# EAGLE board mother-002 (EAGLE 4.16)
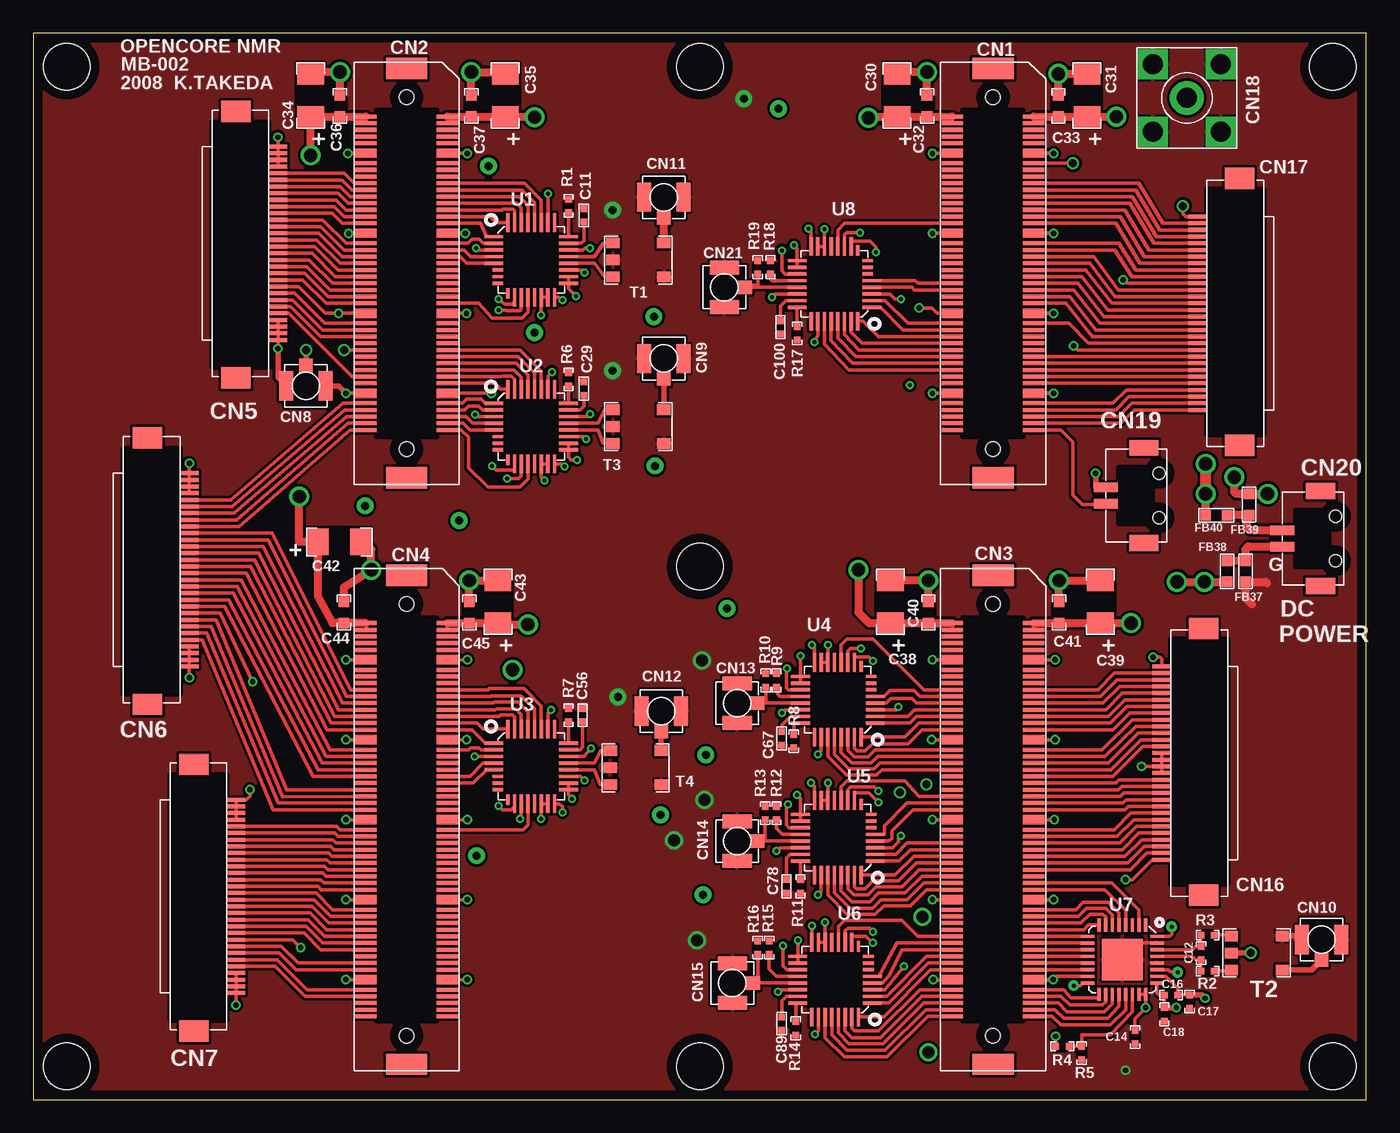
[diagram p14: board, top side]
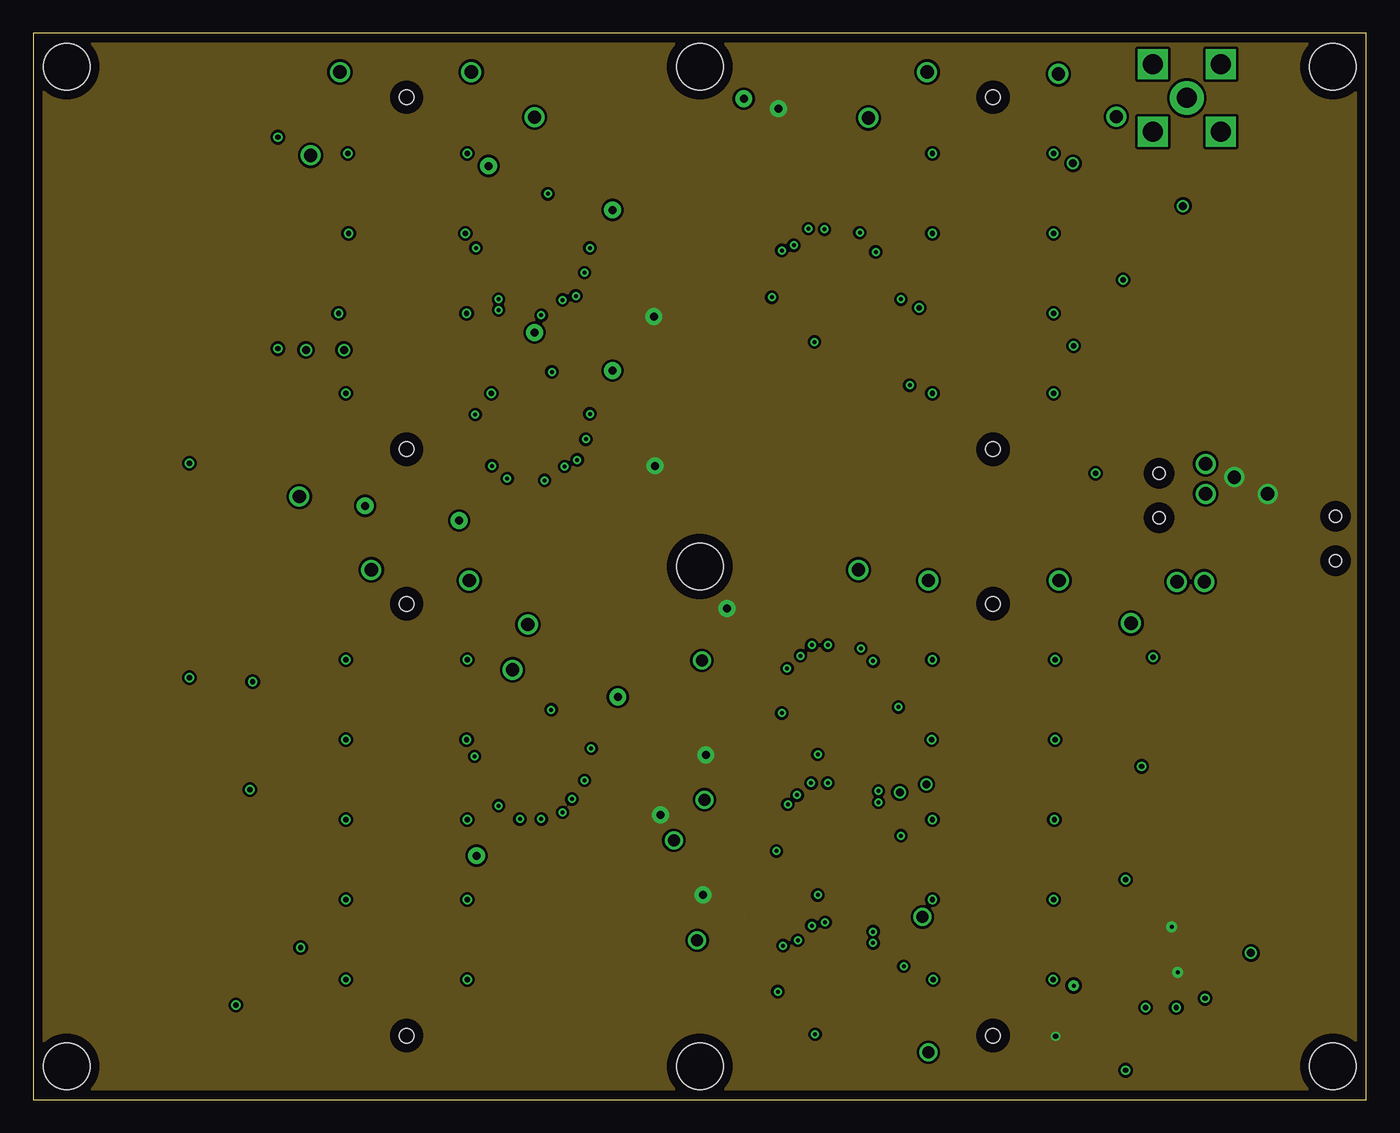
[diagram p15: board, inner layer Route2]
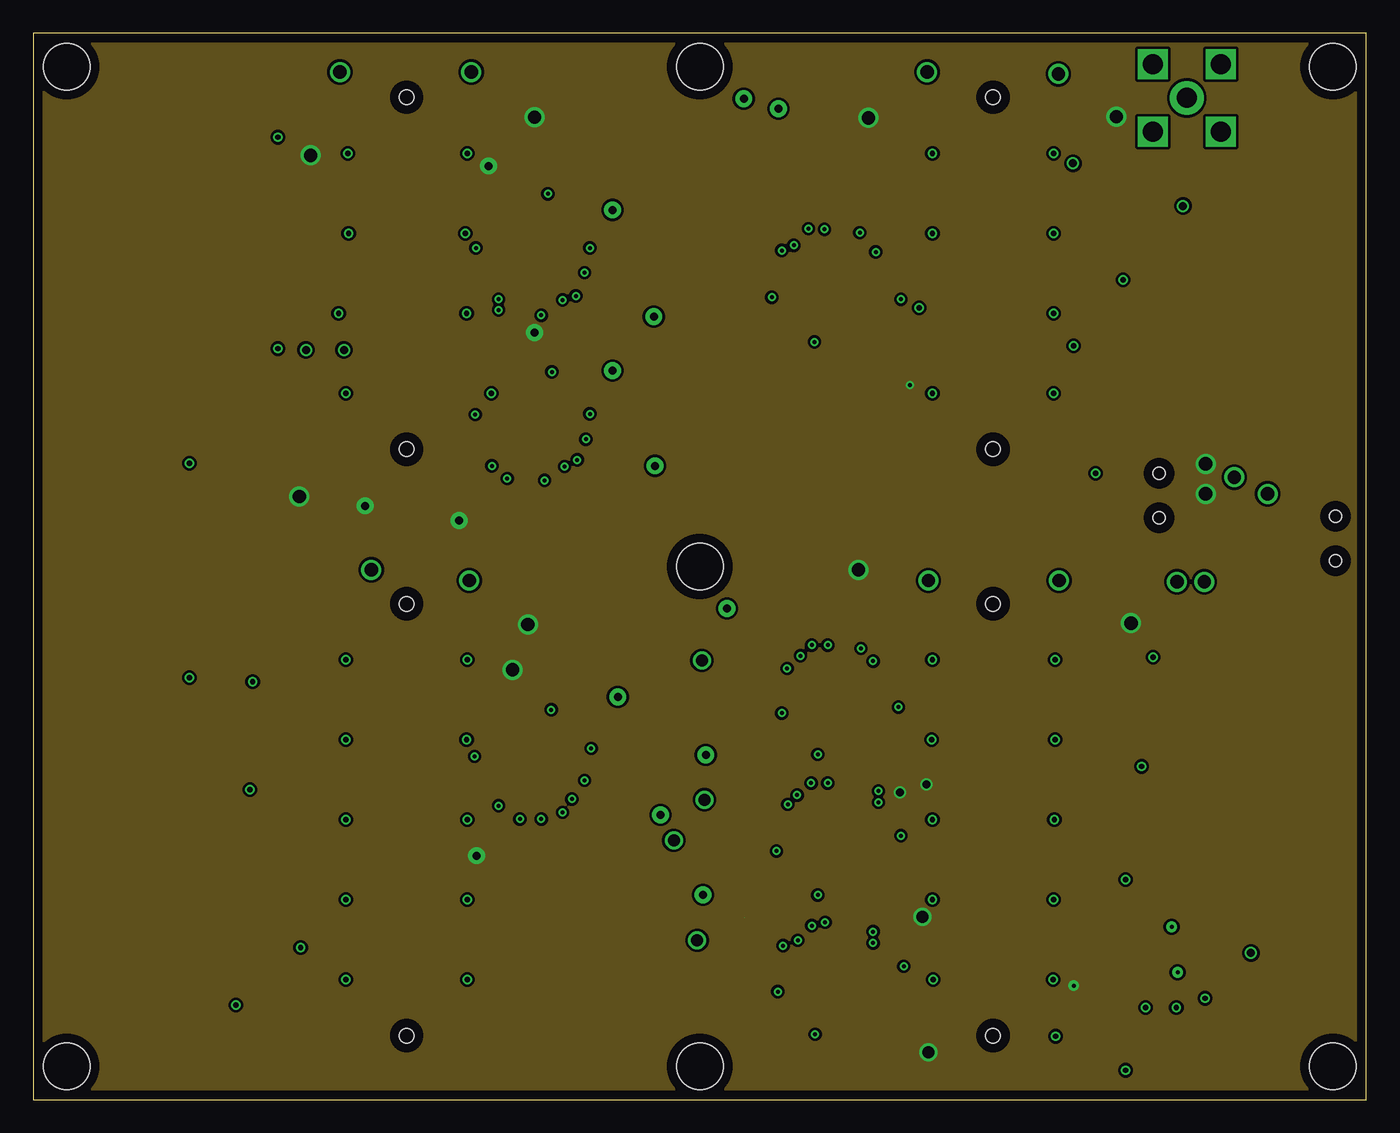
[diagram p16: board, inner layer Route3]
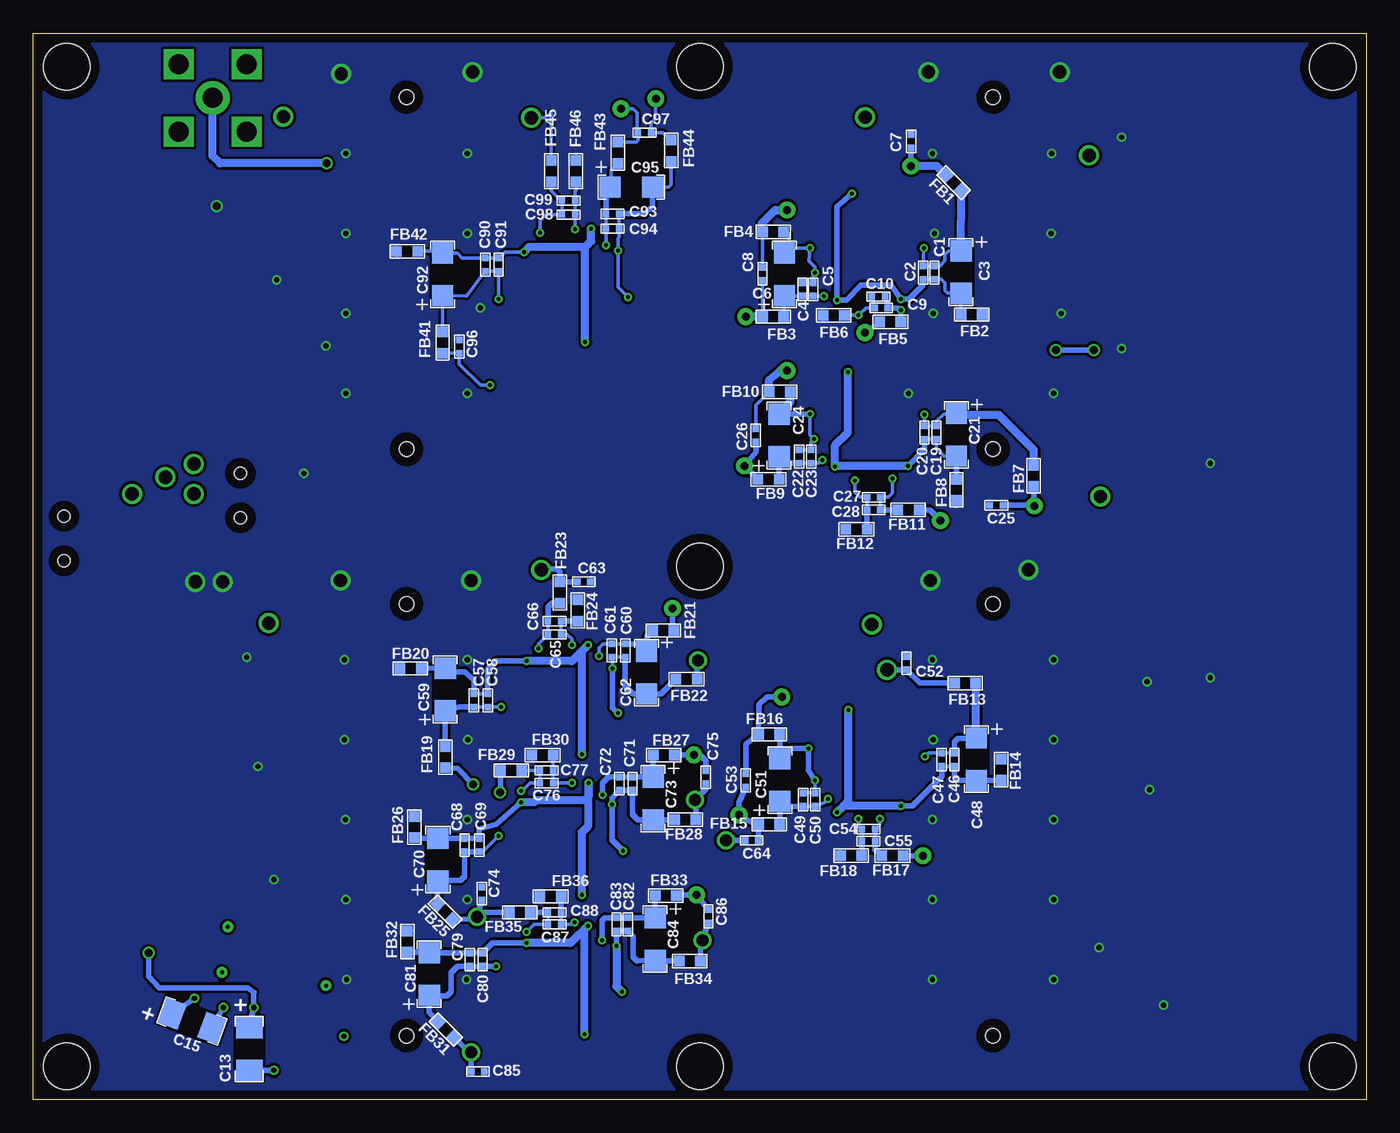
[diagram p17: board, bottom side, seen from below]

Size 100 x 80 mm. Coordinates in mm from the lower left corner, seen from the top.
Outline: 0,0 100,0 100,80 0,80 0,0
Copper layers [2:(1+2*3+16):3]: Top 0.035mm / dielectric 1.5mm / Route2 0.035mm / dielectric 0.15mm / Route3 0.035mm / dielectric 0.2mm / Bottom 0.035mm
Design rules "p-ban_min": minimum track width 0.15mm, minimum drill 0.3mm, track to track 0.15mm, track to pad 0.15mm, pad to pad 0.15mm, via to via 0.15mm, smd to smd 0.15mm, copper to edge 0.7mm, drill to drill 0.45mm, minimum pad ring 0.15mm, minimum via ring 0.15mm, stop-mask expansion 4mil, vias tented up to drill 0mil, thermal gap 0.15mm
Holes 3.5 mm at 2.5,2.5 2.5,77.5 97.5,77.5 97.5,2.5 50,77.5 50,2.5 50,40

## Footprints (pad centres in the part's own frame; a part is rotated, then mirrored left to right if it is on the bottom)
1005 = smd 0.5 x 0.5: 1 -0.5,0; 2 0.5,0
3216_POLAR = smd 1.6 x 1.6: 1 -1.63,0; 2 1.57,0
3216_POLAR' = smd 1.6 x 2: P$1 -1.6,0; P$2 1.6,0
1608 = smd 0.8 x 0.8: 1 -0.8,0; 2 0.8,0
FX10A-80S/8-SV = smd 0.3 x 1.6: 1 -11.75,3.05; 2 -11.75,-3.05; 3 -11.25,3.05; 4 -11.25,-3.05; 5 -10.75,3.05; 6 -10.75,-3.05; 7 -10.25,3.05; 8 -10.25,-3.05; 9 -9.75,3.05; 10 -9.75,-3.05; 11 -8.25,3.05; 12 -8.25,-3.05; 13 -7.75,3.05; 14 -7.75,-3.05; 15 -7.25,3.05; 16 -7.25,-3.05; 17 -6.75,3.05; 18 -6.75,-3.05; 19 -6.25,3.05; 20 -6.25,-3.05; 21 -5.75,3.05; 22 -5.75,-3.05; 23 -5.25,3.05; 24 -5.25,-3.05; 25 -4.75,3.05; 26 -4.75,-3.05; 27 -4.25,3.05; 28 -4.25,-3.05; 29 -3.75,3.05; 30 -3.75,-3.05; 31 -2.25,3.05; 32 -2.25,-3.05; 33 -1.75,3.05; 34 -1.75,-3.05; 35 -1.25,3.05; 36 -1.25,-3.05; 37 -0.75,3.05; 38 -0.75,-3.05; 39 -0.25,3.05; 40 -0.25,-3.05; 41 0.25,3.05; 42 0.25,-3.05; 43 0.75,3.05; 44 0.75,-3.05; 45 1.25,3.05; 46 1.25,-3.05; 47 1.75,3.05; 48 1.75,-3.05; 49 2.25,3.05; 50 2.25,-3.05; 51 3.75,3.05; 52 3.75,-3.05; 53 4.25,3.05; 54 4.25,-3.05; 55 4.75,3.05; 56 4.75,-3.05; 57 5.25,3.05; 58 5.25,-3.05; 59 5.75,3.05; 60 5.75,-3.05; 61 6.25,3.05; 62 6.25,-3.05; 63 6.75,3.05; 64 6.75,-3.05; 65 7.25,3.05; 66 7.25,-3.05; 67 7.75,3.05; 68 7.75,-3.05; 69 8.25,3.05; 70 8.25,-3.05; 71 9.75,3.05; 72 9.75,-3.05; 73 10.25,3.05; 74 10.25,-3.05; 75 10.75,3.05; 76 10.75,-3.05; 77 11.25,3.05; 78 11.25,-3.05; 79 11.75,3.05; 80 11.75,-3.05 | smd 0.7 x 1.6: G1 -9,3.05; G2 -9,-3.05; G3 -3,3.05; G4 -3,-3.05; G5 3,3.05; G6 3,-3.05; G7 9,3.05; G8 9,-3.05 | smd 1.6 x 3.1: NC1 -15.35,0; NC2 15.35,0 | hole 1.1: -13.2,0; 13.2,0
FX10A-100S/10-SV = smd 0.3 x 1.6: 1 -14.75,3.05; 2 -14.75,-3.05; 3 -14.25,3.05; 4 -14.25,-3.05; 5 -13.75,3.05; 6 -13.75,-3.05; 7 -13.25,3.05; 8 -13.25,-3.05; 9 -12.75,3.05; 10 -12.75,-3.05; 11 -11.25,3.05; 12 -11.25,-3.05; 13 -10.75,3.05; 14 -10.75,-3.05; 15 -10.25,3.05; 16 -10.25,-3.05; 17 -9.75,3.05; 18 -9.75,-3.05; 19 -9.25,3.05; 20 -9.25,-3.05; 21 -8.75,3.05; 22 -8.75,-3.05; 23 -8.25,3.05; 24 -8.25,-3.05; 25 -7.75,3.05; 26 -7.75,-3.05; 27 -7.25,3.05; 28 -7.25,-3.05; 29 -6.75,3.05; 30 -6.75,-3.05; 31 -5.25,3.05; 32 -5.25,-3.05; 33 -4.75,3.05; 34 -4.75,-3.05; 35 -4.25,3.05; 36 -4.25,-3.05; 37 -3.75,3.05; 38 -3.75,-3.05; 39 -3.25,3.05; 40 -3.25,-3.05; 41 -2.75,3.05; 42 -2.75,-3.05; 43 -2.25,3.05; 44 -2.25,-3.05; 45 -1.75,3.05; 46 -1.75,-3.05; 47 -1.25,3.05; 48 -1.25,-3.05; 49 -0.75,3.05; 50 -0.75,-3.05; 51 0.75,3.05; 52 0.75,-3.05; 53 1.25,3.05; 54 1.25,-3.05; 55 1.75,3.05; 56 1.75,-3.05; 57 2.25,3.05; 58 2.25,-3.05; 59 2.75,3.05; 60 2.75,-3.05; 61 3.25,3.05; 62 3.25,-3.05; 63 3.75,3.05; 64 3.75,-3.05; 65 4.25,3.05; 66 4.25,-3.05; 67 4.75,3.05; 68 4.75,-3.05; 69 5.25,3.05; 70 5.25,-3.05; 71 6.75,3.05; 72 6.75,-3.05; 73 7.25,3.05; 74 7.25,-3.05; 75 7.75,3.05; 76 7.75,-3.05; 77 8.25,3.05; 78 8.25,-3.05; 79 8.75,3.05; 80 8.75,-3.05; 81 9.25,3.05; 82 9.25,-3.05; 83 9.75,3.05; 84 9.75,-3.05; 85 10.25,3.05; 86 10.25,-3.05; 87 10.75,3.05; 88 10.75,-3.05; 89 11.25,3.05; 90 11.25,-3.05; 91 12.75,3.05; 92 12.75,-3.05; 93 13.25,3.05; 94 13.25,-3.05; 95 13.75,3.05; 96 13.75,-3.05; 97 14.25,3.05; 98 14.25,-3.05; 99 14.75,3.05; 100 14.75,-3.05 | smd 0.7 x 1.6: G1 -12,3.05; G2 -12,-3.05; G3 -6,3.05; G4 -6,-3.05; G5 0,3.05; G6 0,-3.05; G7 6,3.05; G8 6,-3.05; G9 12,3.05; G10 12,-3.05 | smd 1.6 x 3.1: NC1 -18.35,0; NC2 18.35,0 | hole 1.1: -16.2,0; 16.2,0
FPC_30 = smd 0.3 x 1.4: 1 -7,2.7; 2 -6.5,2.7; 3 -6,2.7; 4 -5.5,2.7; 5 -5,2.7; 6 -4.5,2.7; 7 -4,2.7; 8 -3.5,2.7; 9 -3,2.7; 10 -2.5,2.7; 11 -2,2.7; 12 -1.5,2.7; 13 -1,2.7; 14 -0.5,2.7; 15 0,2.7; 16 0.5,2.7; 17 1,2.7; 18 1.5,2.7; 19 2,2.7; 20 2.5,2.7; 21 3,2.7; 22 3.5,2.7; 23 4,2.7; 24 4.5,2.7; 25 5,2.7; 26 5.5,2.7; 27 6,2.7; 28 6.5,2.7; 29 7,2.7; 30 7.5,2.7 | smd 1.6 x 2.2: P$21 -9.65,-0.45; P$22 10.35,-0.45
U.FL-R-SMT = smd 1 x 1.05: P$1 0,1.525 | smd 1.05 x 2.2: P$2 1.475,0; P$3 -1.475,0
SMA_STRAIGHT = drill 1.5 pad 2.54 round: 1 0,0 | drill 1.5 square: 2 -2.54,2.54; 3 2.54,2.54; 4 -2.54,-2.54; 5 2.54,-2.54
DF13-2P-12.5V = smd 0.7 x 1.8: 1 -0.625,4; 2 0.625,4 | smd 1.2 x 2.2: 3 -3.575,1.13; 4 3.575,1.13 | hole 0.9: -1.675,0; 1.675,0
AT224 = smd 1 x 0.8: 1 -1.925,1.275; 2 -1.925,0; 3 -1.925,-1.275; 4 1.9,-1.275; 6 1.9,1.275
AD9740ACP = smd 1.4 x 0.25: 1 -2.8,1.75; 2 -2.8,1.25; 3 -2.8,0.75; 4 -2.8,0.25; 5 -2.8,-0.25; 17 2.8,-1.75; 18 2.8,-1.25; 19 2.8,-0.75; 20 2.8,-0.25; 21 2.8,0.25; 22 2.8,0.75; 23 2.8,1.25; 24 2.8,1.75 | smd 0.8 x 0.25: 6 -2.5,-0.75; 7 -2.5,-1.25; 8 -2.5,-1.75 | smd 0.25 x 0.8: 9 -1.75,-2.5 | smd 0.25 x 1.4: 10 -1.25,-2.8; 11 -0.75,-2.8; 12 -0.25,-2.8; 13 0.25,-2.8; 14 0.75,-2.8; 15 1.25,-2.8; 16 1.75,-2.8; 25 1.75,2.8; 26 1.25,2.8; 27 0.75,2.8; 28 0.25,2.8; 29 -0.25,2.8; 30 -0.75,2.8; 31 -1.25,2.8; 32 -1.75,2.8
AD9245 = smd 1 x 0.25: 1 -2.6,1.75; 2 -2.6,1.25; 3 -2.6,0.75; 4 -2.6,0.25; 5 -2.6,-0.25; 6 -2.6,-0.75; 7 -2.6,-1.25; 8 -2.6,-1.75; 17 2.6,-1.75; 18 2.6,-1.25; 19 2.6,-0.75; 20 2.6,-0.25; 21 2.6,0.25; 22 2.6,0.75; 23 2.6,1.25; 24 2.6,1.75 | smd 0.25 x 1: 9 -1.75,-2.6; 10 -1.25,-2.6; 11 -0.75,-2.6; 12 -0.25,-2.6; 13 0.25,-2.6; 14 0.75,-2.6; 15 1.25,-2.6; 16 1.75,-2.6; 25 1.75,2.6; 26 1.25,2.6; 27 0.75,2.6; 28 0.25,2.6; 29 -0.25,2.6; 30 -0.75,2.6; 31 -1.25,2.6; 32 -1.75,2.6 | smd 3.1 x 3.1: G 0,0

## Placement (x,y rotation side)
C1  0.1u  [1005]  32.4,62.05 270 bottom
C2  1000p  [1005]  33.25,62.05 270 bottom
C3  33u  [3216_POLAR]  30.4,62.05 270 bottom
C4  0.1u  [1005]  42.3,60.8 90 bottom
C5  1000p  [1005]  41.5,60.8 90 bottom
C6  33u  [3216_POLAR]  43.65,61.95 90 bottom
C7  0.1u  [1005]  34.15,71.9 90 bottom
C8  0.1u  [1005]  45.3,61.95 90 bottom
C9  1000p  [1005]  36.4,59.4 180 bottom
C10  0.1u  [1005]  36.6,60.25 180 bottom
C11  0.1u  [1005]  41.3,66.35 90 top
C12  20p  [1005]  87.6,11 90 top
C13  10uF  [3216_POLAR']  83.8,3.8 270 bottom
C14  0.1uF  [1005]  82.65,4.7 270 top
C15  10uF  [3216_POLAR']  88.1,5.9 340 bottom
C16  0.1u  [1005]  85.35,7.85 0 top
C17  0.1u  [1005]  86.75,7.35 270 top
C18  0.1u  [1005]  84.85,6.4 270 top
C19  0.1u  [1005]  32.25,50.05 270 bottom
C20  1000p  [1005]  33.15,50.05 270 bottom
C21  33u  [3216_POLAR]  30.75,49.85 270 bottom
C22  0.1u  [1005]  42.55,48.25 90 bottom
C23  1000p  [1005]  41.65,48.25 90 bottom
C24  33u  [3216_POLAR]  44.05,49.85 90 bottom
C25  0.1u  [1005]  27.75,44.6 180 bottom
C26  0.1u  [1005]  45.8,49.85 90 bottom
C27  1000p  [1005]  36.95,45.2 180 bottom
C28  0.1u  [1005]  36.95,44.25 180 bottom
C29  0.1u  [1005]  41.3,53.35 90 top
C30  33u  [3216_POLAR']  64.8,75.35 90 top
C31  33u  [3216_POLAR']  79.05,75.35 90 top
C32  0.01u  [1608]  67.05,74.55 90 top
C33  0.01u  [1608]  76.9,74.55 90 top
C34  33u  [3216_POLAR']  20.8,75.35 90 top
C35  33u  [3216_POLAR']  35.4,75.35 90 top
C36  0.01u  [1608]  23,74.55 90 top
C37  0.01u  [1608]  32.85,74.55 90 top
C38  33u  [3216_POLAR']  64.3,37.35 90 top
C39  33u  [3216_POLAR']  80.05,37.35 90 top
C40  0.01u  [1608]  67.15,36.55 90 top
C41  0.01u  [1608]  76.95,36.55 90 top
C42  33u  [3216_POLAR']  22.95,41.85 0 top
C43  33u  [3216_POLAR']  34.85,37.35 90 top
C44  0.01u  [1608]  23.3,36.55 90 top
C45  0.01u  [1608]  32.7,36.55 90 top
C46  0.1u  [1005]  30.9,25.5 270 bottom
C47  1000p  [1005]  31.85,25.5 270 bottom
C48  33u  [3216_POLAR]  29.25,25.5 270 bottom
C49  0.1u  [1005]  42.25,22.5 90 bottom
C50  1000p  [1005]  41.35,22.5 90 bottom
C51  33u  [3216_POLAR]  44,24 90 bottom
C52  0.1u  [1005]  34.5,32.75 90 bottom
C53  0.1u  [1005]  46.55,23.95 90 bottom
C54  1000p  [1005]  37.35,20.3 180 bottom
C55  0.1u  [1005]  37.35,19.4 180 bottom
C56  0.1u  [1005]  41.2,28.85 90 top
C57  0.1u  [1005]  66.95,29.95 90 bottom
C58  1000p  [1005]  65.9,29.95 90 bottom
C59  33u  [3216_POLAR]  69.1,30.8 90 bottom
C60  0.1u  [1005]  55.6,33.7 270 bottom
C61  1000p  [1005]  56.6,33.7 270 bottom
C62  33u  [3216_POLAR]  54,32 270 bottom
C63  0.1u  [1005]  58.7,38.85 0 bottom
C64  0.1u  [1005]  46.1,19.45 180 bottom
C65  1000p  [1005]  60.9,34.9 0 bottom
C66  0.1u  [1005]  60.9,35.9 0 bottom
C67  0.1u  [1005]  56.15,27.1 270 top
C68  0.1u  [1005]  67.65,19.1 90 bottom
C69  1000p  [1005]  66.55,19.1 90 bottom
C70  33u  [3216_POLAR]  69.65,18.03 90 bottom
C71  0.1u  [1005]  55.05,23.7 270 bottom
C72  1000p  [1005]  56.05,23.7 270 bottom
C73  33u  [3216_POLAR]  53.5,22.55 270 bottom
C74  0.1u  [1005]  66.35,15.45 90 bottom
C75  0.1u  [1005]  49.55,24.2 270 bottom
C76  1000p  [1005]  61.5,23.75 0 bottom
C77  0.1u  [1005]  61.5,24.7 0 bottom
C78  0.1u  [1005]  56.5,16 270 top
C79  0.1u  [1005]  67.25,10.5 90 bottom
C80  1000p  [1005]  66.3,10.5 90 bottom
C81  33u  [3216_POLAR]  70.3,9.45 90 bottom
C82  0.1u  [1005]  55.4,13.15 270 bottom
C83  1000p  [1005]  56.25,13.15 270 bottom
C84  33u  [3216_POLAR]  53.35,12 270 bottom
C85  0.1u  [1005]  66.65,2.1 0 bottom
C86  0.1u  [1005]  49.35,13.75 270 bottom
C87  1000p  [1005]  60.9,13.15 0 bottom
C88  0.1u  [1005]  60.9,14.05 0 bottom
C89  0.1u  [1005]  56.15,5.7 270 top
C90  0.1u  [1005]  66.1,62.65 90 bottom
C91  1000p  [1005]  65.1,62.65 90 bottom
C92  33u  [3216_POLAR]  69.3,61.95 90 bottom
C93  0.1u  [1005]  56.55,66.45 0 bottom
C94  1000p  [1005]  56.55,65.35 0 bottom
C95  33u  [3216_POLAR]  55.1,68.45 0 bottom
C96  0.1u  [1005]  68.05,56.5 90 bottom
C97  0.1u  [1005]  54.15,72.55 0 bottom
C98  1000p  [1005]  59.85,66.4 0 bottom
C99  0.1u  [1005]  59.85,67.45 0 bottom
C100  0.1u  [1005]  56.05,57.95 270 top
CN1  FX10A-80S/8-SV  [FX10A-80S/8-SV]  72,62 270 top
CN2  FX10A-80S/8-SV  [FX10A-80S/8-SV]  28,62 270 top
CN3  FX10A-100S/10-SV  [FX10A-100S/10-SV]  72,21 270 top
CN4  FX10A-100S/10-SV  [FX10A-100S/10-SV]  28,21 270 top
CN5  FH12-30S-0.5SH  [FPC_30]  15.65,64.5 270 top
CN6  FH12-30S-0.5SH  [FPC_30]  9,40 270 top
CN7  FH12-30S-0.5SH  [FPC_30]  12.5,15.5 270 top
CN8  U.FL-R-SMT  [U.FL-R-SMT]  20.45,53.55 0 top
CN9  U.FL-R-SMT  [U.FL-R-SMT]  47.3,55.6 180 top
CN10  U.FL-R-SMT  [U.FL-R-SMT]  96.65,12 180 top
CN11  U.FL-R-SMT  [U.FL-R-SMT]  47.3,67.7 180 top
CN12  U.FL-R-SMT  [U.FL-R-SMT]  47.1,29.15 180 top
CN13  U.FL-R-SMT  [U.FL-R-SMT]  52.8,29.75 270 top
CN14  U.FL-R-SMT  [U.FL-R-SMT]  52.8,19.4 270 top
CN15  U.FL-R-SMT  [U.FL-R-SMT]  52.45,8.75 270 top
CN16  FH12-30S-0.5SH  [FPC_30]  87.35,25 90 top
CN17  FH12-30S-0.5SH  [FPC_30]  90.05,58.75 90 top
CN18  SMASTRAIGHT  [SMA_STRAIGHT]  86.55,75.15 0 top
CN19  DF13-2P-1.25V  [DF13-2P-12.5V]  84.45,45.33 90 top
CN20  DF13-2P-1.25V  [DF13-2P-12.5V]  97.7,42.1 90 top
CN21  U.FL-R-SMT  [U.FL-R-SMT]  51.85,60.95 270 top
FB1  FERRITEBEAD  [1608]  30.95,68.8 315 bottom
FB2  FERRITEBEAD  [1608]  29.6,58.9 180 bottom
FB3  FERRITEBEAD  [1608]  44.5,58.75 0 bottom
FB4  FERRITEBEAD  [1608]  44.5,65.1 0 bottom
FB5  FERRITEBEAD  [1608]  35.7,58.35 0 bottom
FB6  FERRITEBEAD  [1608]  39.95,58.85 180 bottom
FB7  FERRITEBEAD  [1608]  24.95,46.8 90 bottom
FB8  FERRITEBEAD  [1608]  30.75,45.75 90 bottom
FB9  FERRITEBEAD  [1608]  44.85,46.55 0 bottom
FB10  FERRITEBEAD  [1608]  44,53.1 0 bottom
FB11  FERRITEBEAD  [1608]  34.35,44.25 180 bottom
FB12  FERRITEBEAD  [1608]  38.25,42.8 180 bottom
FB13  FERRITEBEAD  [1608]  30.1,31.25 0 bottom
FB14  FERRITEBEAD  [1608]  27.4,24.75 270 bottom
FB15  FERRITEBEAD  [1608]  44.8,20.65 0 bottom
FB16  FERRITEBEAD  [1608]  44.8,27.4 0 bottom
FB17  FERRITEBEAD  [1608]  35.55,18.3 180 bottom
FB18  FERRITEBEAD  [1608]  38.65,18.3 180 bottom
FB19  FERRITEBEAD  [1608]  69.1,25.7 90 bottom
FB20  FERRITEBEAD  [1608]  71.7,32.35 0 bottom
FB21  FERRITEBEAD  [1608]  52.75,35.2 180 bottom
FB22  FERRITEBEAD  [1608]  51,31.55 180 bottom
FB23  FERRITEBEAD  [1608]  60.5,38.05 270 bottom
FB24  FERRITEBEAD  [1608]  59.15,36.7 90 bottom
FB25  FERRITEBEAD  [1608]  69.1,14.1 135 bottom
FB26  FERRITEBEAD  [1608]  71.4,20.45 270 bottom
FB27  FERRITEBEAD  [1608]  52.7,25.85 180 bottom
FB28  FERRITEBEAD  [1608]  51.1,21 180 bottom
FB29  FERRITEBEAD  [1608]  64.15,24.7 0 bottom
FB30  FERRITEBEAD  [1608]  61.8,25.85 180 bottom
FB31  FERRITEBEAD  [1608]  69.05,5.25 135 bottom
FB32  FERRITEBEAD  [1608]  71.95,11.85 270 bottom
FB33  FERRITEBEAD  [1608]  52.55,15.3 180 bottom
FB34  FERRITEBEAD  [1608]  50.75,10.4 180 bottom
FB35  FERRITEBEAD  [1608]  63.5,14.05 0 bottom
FB36  FERRITEBEAD  [1608]  61.2,15.25 180 bottom
FB37  FERRITEBEAD  [1608]  90.95,39.65 90 top
FB38  FERRITEBEAD  [1608]  89.55,39.65 90 top
FB39  FERRITEBEAD  [1608]  91.2,44.65 270 top
FB40  FERRITEBEAD  [1608]  88.75,43.85 0 top
FB41  FERRITEBEAD  [1608]  69.3,56.8 90 bottom
FB42  FERRITEBEAD  [1608]  71.95,63.65 0 bottom
FB43  FERRITEBEAD  [1608]  56.15,71.05 270 bottom
FB44  FERRITEBEAD  [1608]  52.15,71.2 270 bottom
FB45  FERRITEBEAD  [1608]  61.15,69.65 270 bottom
FB46  FERRITEBEAD  [1608]  59.3,69.65 90 bottom
R1  2k  [1005]  40.15,67.05 270 top
R2  33  [1005]  88.1,9.65 180 top
R3  33  [1005]  88.1,12.35 180 top
R4  1k  [1005]  77.2,4 180 top
R5  2k  [1005]  78.65,3.5 90 top
R6  2k  [1005]  40.15,54.05 270 top
R7  2k  [1005]  40.15,28.85 270 top
R8  2k  [1005]  57.05,26.9 90 top
R9  50  [1005]  55.75,31.45 270 top
R10  100  [1005]  54.95,31.45 270 top
R11  2k  [1005]  57.55,16 90 top
R12  50  [1005]  55.75,21.5 270 top
R13  100  [1005]  54.9,21.5 270 top
R14  2k  [1005]  57.2,5.35 90 top
R15  50  [1005]  55.2,11.4 270 top
R16  100  [1005]  54.35,11.4 270 top
R17  2k  [1005]  57.3,57.5 90 top
R18  50  [1005]  55.3,62.45 270 top
R19  100  [1005]  54.35,62.45 270 top
T1  TC1-1T+  [AT224]  45.4,63 0 top
T2  TC1-1T+  [AT224]  91.8,11 0 top
T3  TC1-1T+  [AT224]  45.4,50.5 0 top
T4  TC1-1T+  [AT224]  45.2,24.9 0 top
U1  AD9740ACPZ  [AD9740ACP]  37.35,63 0 top
U2  AD9740ACPZ  [AD9740ACP]  37.35,50.5 0 top
U3  AD9740ACPZ  [AD9740ACP]  37.35,25 0 top
U4  AD9740ACPZ  [AD9740ACP]  60.35,30 180 top
U5  AD9740ACPZ  [AD9740ACP]  60.35,19.65 180 top
U6  AD9740ACPZ  [AD9740ACP]  60.15,9 180 top
U7  AD9245BCPZ-80  [AD9245]  81.7,10.5 270 top
U8  AD9740ACPZ  [AD9740ACP]  60.1,61.2 180 top

## Tracks (layer width: path | path; a pad name or v marks a point on that pad's centre or on a via)
A0_U1  (via drill 0.3 pad 0.6)
  Top 0.254: U1.22 41.25,63.75 41.4,63.9 v41.75,63.9 | U1.19 41.15,62.25 v41.35,62.05
  Bottom 0.254: C4.2 C5.2 41.5,61.9 v41.35,62.05 41.35,62.45 41.8,62.9 v41.75,63.9 43.27,63.9 | 43.27,63.9 C6.2 | FB4.2 43.45,65.1 43.3,64.95 43.3,63.93 43.27,63.9
A0_U2  (via drill 0.3)
  Top 0.254: U2.22 41.55,51.25 v41.75,51.45 | U2.19 41.25,49.75 v41.45,49.55
  Bottom 0.254: C22.2 C23.2 41.65,49.35 v41.45,49.55 41.75,49.85 v41.75,51.45
  Bottom 0.406: v41.75,51.45 44.02,51.45 C24.2
  Bottom 0.61: FB10.2 43.2,52.35 43.35,52.2 43.35,52.12 44.02,51.45
A0_U3  (via drill 0.3)
  Top 0.254: U3.19 41.05,24.25 v41.35,23.95 | U3.22 41.3,25.75 v41.85,26.35
  Bottom 0.254: v41.35,23.95 C50.2 C49.2
  Bottom 0.406: v41.35,23.95 41.85,24.7 v41.85,26.35 43.12,26.35 C51.2 | C51.2 FB16.2 | C51.2 44,25.8
A0_U4  (via drill 0.3)
  Top 0.254: U4.19 56.65,30.75 56.5,30.9 56.5,31.9 v56.55,32.35 | U4.22 56.4,29.25 v56.15,29
  Bottom 0.254: v56.55,32.35 56.55,33.15 C61.2 C60.2
  Bottom 0.406: C60.2 55.6,31.05 55,30.45 C62.2 52.92,30.43 FB22.2 | v56.55,32.35 56.55,29.4 v56.15,29
A0_U5  (via drill 0.3)
  Top 0.254: U5.19 56.7,20.4 56.5,20.6 56.5,22.05 v56.6,22.15 | U5.22 56,18.9 v55.75,18.65
  Bottom 0.406: v55.75,18.65 56.6,19.5 v56.6,22.15 56.6,22.65 C72.2 C71.2 55.05,21.4 54.65,21 53.52,21 C73.2 53.48,21 FB28.2
A0_U6  (via drill 0.3)
  Top 0.254: U6.22 56,8.25 v55.85,8.1 | U6.19 56.55,9.75 56.25,10.05 v56.25,11.55
  Bottom 0.406: v56.25,11.55 C83.2 C82.2 55,12.25 55,10.7 54.7,10.4 C84.2 53.32,10.4 FB34.2
  Bottom 0.61: v55.85,8.1 56.25,8.5 v56.25,11.55
A0_U8  (via drill 0.3 pad 0.6)
  Top 0.254: U8.19 56.4,61.95 56.15,62.2 v56.15,63.7 | U8.22 55.65,60.45 v55.4,60.2
  Bottom 0.254: v55.4,60.2 56.15,60.95 v56.15,63.7 56.15,64.6 56.05,64.7 C94.2 C93.2 | FB44.2 52.15,68.65 52.35,68.45 C95.2
  Bottom 0.406: C93.2 54.15,66.45 53.55,67.05 53.55,68.43 C95.2
A33_U1  (via drill 0.3 pad 0.6)
  Top 0.254: U1.18 U1.17 40.15,60.85 v40.7,60.3
  Bottom 0.254: v40.7,60.3 C5.1 C4.1 43.63,60.3 | 43.63,60.3 C6.1 | FB3.2 43.7,60.23 43.63,60.3
A33_U2  (via drill 0.3)
  Top 0.254: U2.18 U2.17 40.15,48.2 40.35,48 v40.8,48
  Bottom 0.254: v40.8,48 41.05,47.75 C23.1 C22.1
  Bottom 0.406: C22.1 43.58,47.75 C24.1 FB9.2
A33_U3  (via drill 0.3)
  Top 0.254: U3.18 U3.17 40.15,22.85 v40.4,22.55
  Bottom 0.254: v40.4,22.55 40.7,22.25 C50.1 C49.1
  Bottom 0.406: C49.1 43.58,22 C51.1 FB15.2
A33_U4  (via drill 0.3)
  Top 0.254: U4.18 U4.17 v57.55,33.3
  Bottom 0.254: v57.55,33.3 57.55,33.9 57.25,34.2 C61.1 C60.1
  Bottom 0.406: C60.1 54.57,34.2 C62.1 53.95,34.8 FB21.2
A33_U5  (via drill 0.3)
  Top 0.254: U5.18 U5.17 57.55,22.6 v57.3,22.85
  Bottom 0.406: v57.3,22.85 57.3,23.75 56.85,24.2 C72.1 C71.1 53.52,24.2 | 53.52,24.2 C73.1 | FB27.2 53.5,24.22 53.52,24.2
A33_U6  (via drill 0.3)  (1 unrouted)
  Top 0.254: U6.18 U6.17 v57.35,11.95
  Bottom 0.406: C84.1 C82.1 C83.1 57.1,13.65 57.35,13.4 v57.35,11.95 | C84.1 FB33.2
A33_U8  (via drill 0.3 pad 0.6)
  Top 0.254: U8.18 U8.17 57.3,63.85 v57.05,64.1
  Bottom 0.254: v57.05,64.1 C94.1 C93.1 | FB43.2 56.15,70.2 56.65,69.7 56.65,68.53 C95.1
  Bottom 0.406: C93.1 57.05,68.13 C95.1
ACBUS0
  Top 0.254: CN3.23 80.45,29.25 81.7,30.5 CN16.26
ACBUS1
  Top 0.254: CN3.21 80.25,29.75 81.5,31 CN16.27
ACBUS2
  Top 0.254: CN3.19 80.05,30.25 81.3,31.5 CN16.28
ACBUS3
  Top 0.254: CN3.17 79.85,30.75 81.1,32 CN16.29
ADBUS0
  Top 0.254: CN3.39 81,24.25 83.25,26.5 CN16.18
ADBUS1
  Top 0.254: CN3.37 80.85,24.75 83.1,27 CN16.19
ADBUS2
  Top 0.254: CN3.35 80.65,25.25 82.9,27.5 CN16.20
ADBUS3
  Top 0.254: CN3.33 80.4,25.75 82.7,28 CN16.21
ADBUS4
  Top 0.254: CN3.31 80.15,26.25 82.45,28.5 CN16.22
ADBUS5
  Top 0.254: CN3.29 81,27.75 82.25,29 CN16.23
ADBUS6
  Top 0.254: CN3.27 80.8,28.25 82.05,29.5 CN16.24
ADBUS7
  Top 0.254: CN3.25 80.65,28.75 81.9,30 CN16.25
ADC_CLK
  Top 0.254: CN3.67 80.9,16.25 82.95,14.25 U7.2
ADC_D0
  Top 0.254: U7.5 81.45,14 80.65,14.8 78.75,14.8 78.2,14.25 CN3.71
ADC_D1
  Top 0.254: CN3.73 78.4,13.75 79,14.35 80.45,14.35 80.95,13.85 U7.6
ADC_D2
  Top 0.254: CN3.75 78.6,13.25 79.25,13.9 80.25,13.9 80.45,13.7 U7.7
ADC_D3
  Top 0.254: U7.8 79.15,13.1 78.8,12.75 CN3.77
ADC_D4
  Top 0.254: CN3.79 U7.9
ADC_D5
  Top 0.254: CN3.81 U7.10
ADC_D6
  Top 0.254: CN3.83 U7.11
ADC_D7
  Top 0.254: CN3.85 U7.12
ADC_D8
  Top 0.254: CN3.87 U7.13
ADC_D9
  Top 0.254: CN3.89 U7.14
ADC_D10
  Top 0.254: U7.17 79.95,7.75 79.85,7.65 77.85,7.65 77.3,8.25 CN3.91
ADC_D11
  Top 0.254: U7.18 80.45,7.35 80.2,7.1 77.75,7.1 77.1,7.75 CN3.93
ADC_D12
  Top 0.254: U7.19 80.95,7.2 80.35,6.6 77.55,6.6 76.9,7.25 CN3.95
ADC_D13
  Top 0.254: CN3.97 76.65,6.75 77.3,6.1 80.6,6.1 81.45,7 U7.20
ADC_OTR
  Top 0.254: U7.21 81.95,6.75 80.8,5.6 77.1,5.6 76.4,6.25 CN3.99
ADC_PWDN
  Top 0.254: CN3.69 80.4,15.75 81.95,14.2 U7.4
AGND  (via drill 0.4, 0.6 pad 1.27, 0.9)
  Top 0.254: U7.31 82.95,11.75 U7.G
  Top 0.406: CN10.P$2 94.9,12.28 T2.6
  Top 0.61: 92.55,38.75 92.45,38.85 FB37.1 90.95,37.65 91.45,37.15
  Bottom 0.254: C8.2 FB4.1 | C26.2 45.8,52.1 FB10.1 | FB44.1 52.2,72 52.75,72.55 C97.2 53.65,73.25 53.35,73.55 v53.3,75.1
  Bottom 0.406: C13.P$2 v81.95,2.2 | v43.85,30.2 44.95,30.2 45.55,29.65 FB16.1 46.55,26.7 C53.2 | FB22.1 50.2,32.9 v50.15,32.95 | C64.2 v48.05,19.45 | FB28.1 50.3,22.45 v50.35,22.5 49.55,23.3 C75.2 | FB34.1 49.95,11.8 v49.8,11.95 49.8,12.05 C86.2
  Bottom 0.61: v43.45,66.75 44.35,66.75 45.35,65.75 45.35,65.1 FB4.1 | FB10.1 44.8,54 43.95,54.7 v43.45,54.7
  pour Top (isolate 0.2): 0,0 100,0 100,80 0,80
AVDD  (via drill 0.3 pad 0.81, 0.4, 0.6 pad 1.27, 1)
  Top 0.254: R4.2 v76.7,4.75 | U7.32 85.25,12.25 85.4,12.4 v85.4,12.95 | U7.27 85.15,9.75 85.3,9.6 85.8,9.6 v85.85,9.55
  Top 0.61: v92.6,45.45 FB39.1 90.25,45.45 90.1,45.6 v90.1,46.7
  Bottom 0.254: FB3.1 C8.1 | FB43.1 54.8,71.85 54.65,72 C97.1 54.7,72.6 54.7,74.05 55,74.35 v55.9,74.35
  Bottom 0.406: FB9.1 v46.65,47.55 45.8,48.6 C26.1 | C53.1 47.05,22.3 v47.05,21.35 46.3,20.9 FB15.1 C64.1 | v52.05,36.85 52.05,35.3 FB21.1 | FB27.1 v50.45,25.85 50,25.85 49.55,25.4 C75.1 | FB33.1 51.7,15.35 v50.25,15.35 C86.1
  Bottom 0.61: FB3.1 v46.55,58.75
  pour Route2 (isolate 0.2): 0,0 0,80 100,80 100,0
BCBUS0
  Top 0.254: CN3.47 81.75,22.25 82,22.5 CN16.10
BCBUS1
  Top 0.254: CN3.45 81.55,22.75 81.8,23 CN16.11
BCBUS2
  Top 0.254: CN3.43 81.4,23.25 81.65,23.5 CN16.12
BCBUS3
  Top 0.254: CN3.41 81.2,23.75 81.45,24 CN16.13
BDBUS0
  Top 0.254: CN3.63 82.3,17.25 83.55,18.5 CN16.2
BDBUS1
  Top 0.254: CN3.61 82.1,17.75 83.35,19 CN16.3
BDBUS2
  Top 0.254: CN3.59 81.9,18.25 83.15,19.5 CN16.4
BDBUS3
  Top 0.254: CN3.57 81.7,18.75 82.95,20 CN16.5
BDBUS4
  Top 0.254: CN3.55 81.5,19.25 82.75,20.5 CN16.6
BDBUS5
  Top 0.254: CN3.53 81.3,19.75 82.55,21 CN16.7
BDBUS6
  Top 0.254: CN3.51 81.1,20.25 82.35,21.5 CN16.8
BDBUS7
  Top 0.254: CN3.49 81.9,21.75 82.15,22 CN16.9
CLKGND_U1  (via drill 0.3 pad 0.6)
  Top 0.254: U1.15 U1.14 v38.1,58.85
  Bottom 0.254: C10.2 37.1,59.95 36.9,59.75 C9.2 37.55,59.4 v38.1,58.85 FB6.1
CLKGND_U2  (via drill 0.3)
  Top 0.254: U2.15 U2.14 38.1,46.7 v38.35,46.45
  Bottom 0.254: C28.2 C27.2 38,45.2 38.35,45.55 v38.35,46.45
  Bottom 0.406: FB12.1 C28.2
CLKGND_U3  (via drill 0.3)
  Top 0.254: U3.15 U3.14 v38.1,21.05
  Bottom 0.254: v38.1,21.05 38.1,20.5 C54.2 C55.2
  Bottom 0.406: FB18.1 C55.2
CLKGND_U4  (via drill 0.3)
  Top 0.254: v59.6,34.1 U4.14 U4.15
  Bottom 0.254: C66.2 C65.2 59.95,34.9 59.6,34.55 v59.6,34.1
  Bottom 0.406: C66.2 FB24.1
CLKGND_U5  (via drill 0.3)
  Top 0.254: U5.15 U5.14 v59.6,23.75
  Bottom 0.254: v59.6,23.75 C76.2 C77.2 FB30.1
CLKGND_U6  (via drill 0.3)
  Top 0.254: U6.15 U6.14 v59.4,13.3
  Bottom 0.254: C88.2 C87.2 59.55,13.15 v59.4,13.3
  Bottom 0.406: C88.2 FB36.1
CLKGND_U8  (via drill 0.3 pad 0.6)
  Top 0.254: v59.35,65.3 U8.14 U8.15
  Bottom 0.254: v59.35,65.3 C98.2 C99.2 59.35,68.15 59.3,68.2 FB46.1
CLKVDD_U1  (via drill 0.3 pad 0.6)
  Top 0.254: U1.11 36.6,59.3 36.5,59.2 35.45,59.2 35.4,59.25 v34.9,59.25
  Bottom 0.254: v34.9,59.25 35,59.25 | C10.1 36.1,60 35.9,59.8 C9.1
  Bottom 0.406: 35,59.25 35.15,59.4 C9.1 | FB5.2 v34.9,59.25
CLKVDD_U2  (via drill 0.3)
  Top 0.254: U2.11 36.6,46.8 36.4,46.6 v35.55,46.6
  Bottom 0.254: C28.1 C27.1 35.85,45.2 35.55,45.5 v35.55,46.6
  Bottom 0.406: FB11.2 C28.1
CLKVDD_U3  (via drill 0.3)
  Top 0.254: U3.11 36.6,21.2 v36.5,21.05
  Bottom 0.254: v36.5,21.05 36.5,20.65 C54.1 C55.1
  Bottom 0.406: C55.1 36.85,18.75 FB17.2
CLKVDD_U4  (via drill 0.3)
  Top 0.254: U4.11 61.1,33.65 61.3,33.85 v62.1,33.85
  Bottom 0.254: v62.1,33.85 62.1,34.2 C65.1 C66.1
  Bottom 0.406: C66.1 61.4,36.95 61.1,37.25 FB23.2
CLKVDD_U5  (via drill 0.3)
  Top 0.254: U5.11 61.1,23.25 61.3,23.45 63.1,23.45 v63.4,23.15
  Bottom 0.254: v63.4,23.15 63.35,23.15 62.75,23.75 C76.1 C77.1 FB29.2
CLKVDD_U6  (via drill 0.3)
  Top 0.254: U6.11 60.9,12.65 61.1,12.85 62.75,12.85 v63,12.6
  Bottom 0.254: C88.1 C87.1 62.45,13.15 v63,12.6
  Bottom 0.406: C88.1 FB35.2
CLKVDD_U8  (via drill 0.3 pad 0.6)
  Top 0.254: U8.11 60.85,64.9 61,65.05 v62,65.05
  Bottom 0.254: v62,65.05 62,65.95 61.55,66.4 C98.1 C99.1 60.4,67.45 61.15,68.2 FB45.2
D0_U1  (via drill 0.3 pad 0.6)
  Top 0.254: U1.10 36.1,59.85 35.95,59.7 35.35,59.7 v34.9,60.05 | v38.6,67.95 U1.26 | U1.16 39.4,60.2 v39.7,60
  Bottom 0.254: C2.2 C1.2 31.9,61.55 31.6,61.25 31.6,60.7 31.4,60.5 30.42,60.5 C3.2 FB2.2
  Bottom 0.406: C2.2 33.25,61.1 34.3,60.05 v34.9,60.05 35.65,61.1 37.9,61.1 39,60 v39.7,60 39.7,67 v38.6,67.95
D0_U2  (via drill 0.3)
  Top 0.254: U2.26 38.6,54.3 v38.9,54.6 | U2.16 39.65,47.7 v39.85,47.5 | U2.10 36.1,47.35 36,47.25 34.7,47.25 v34.4,47.55
  Bottom 0.254: C20.2 C19.2 32.25,48.85 31.7,48.3 C21.2
  Bottom 0.406: FB8.2 C21.2 | C20.2 33.15,48.8 v34.4,47.55
  Bottom 0.61: v38.9,54.6 38.9,50.05 39.85,49.1 v39.85,47.5 39.8,47.55 v34.4,47.55
D0_U3  (via drill 0.3)
  Top 0.254: U3.26 38.6,29 v38.85,29.25 | U3.16 39.45,22.2 39.7,22 v39.7,21.55 | U3.10 36.1,22 35.85,21.75 35.2,21.75 v34.9,22.05
  Bottom 0.254: C46.2 C47.2
  Bottom 0.406: C46.2 30.9,24.3 30.55,23.95 29.27,23.95 | 29.27,23.95 C48.2 | FB14.2 29.27,23.95 | v34.9,22.05 34.05,22.05 31.85,24.25 C47.2
  Bottom 0.61: v38.85,29.25 38.85,22.4 39.2,22.05 | 39.2,22.05 v39.7,21.55 | v34.9,22.05 39.2,22.05
D0_U4  (via drill 0.3)
  Top 0.254: U4.10 61.6,33.2 62.7,33.2 v63,32.9 | U4.16 58.6,33.9 v58.4,34.1 | v58.85,25.9 59.1,26.15 U4.26
  Bottom 0.254: C58.2 C57.2
  Bottom 0.406: v63,32.9 65.3,32.9 65.9,32.3 C58.2 | C57.2 66.95,31.45 67.6,32.1 68.83,32.1 C59.2 FB20.2
  Bottom 0.61: v63,32.9 59.6,32.9 v58.4,34.1 58.85,33.65 v58.85,25.9
D0_U5  (via drill 0.3)
  Top 0.254: U5.16 58.6,23.5 v58.35,23.75 | U5.10 61.6,23 62.7,23 v63.4,22.3 | U5.26 59.1,15.6 v58.85,15.35
  Bottom 0.406: C70.2 C68.2 C69.2 66.55,20.3 65.3,20.65 v63.4,22.3 | C70.2 69.19,19.67 | C70.2 71.35,19.6 FB26.2
  Bottom 0.61: v58.85,15.35 58.85,20.05 58.35,20.55 v58.35,23.75 58.35,22.7 U5.16 62.25,22.45 62.4,22.3 v63.4,22.3
D0_U6  (via drill 0.3)
  Top 0.254: v58.4,13.05 U6.16 | U6.10 61.4,12.25 62.45,12.25 v63,11.75 | U6.26 58.9,5.15 v58.65,4.9
  Bottom 0.406: v63,11.75 65.55,11.75 C80.2 C79.2 70.28,11 C81.2 70.33,11.05 FB32.2
  Bottom 0.61: v58.65,4.9 58.65,12.8 v58.4,13.05 59.7,11.75 v63,11.75
D0_U8  (via drill 0.3 pad 0.6)
  Top 0.254: U8.10 61.35,64.4 62.75,64.4 63.2,63.95 v63.2,63.6 | U8.16 58.35,65.15 v58.15,65.35 | U8.26 58.85,57.35 v58.6,56.85
  Bottom 0.254: C92.2 68.15,63.5 67.85,63.15 C90.2 C91.2 64.6,63.6 v63.2,63.6 | C92.2 | FB42.2 69.43,63.65 C92.2
  Bottom 0.61: v58.6,56.85 58.6,63.95 | 58.6,63.95 58.15,64.4 v58.15,65.35 | 58.6,63.95 62.85,63.95 v63.2,63.6
D33_U1  (via drill 0.3 pad 0.6)
  Top 0.254: U1.3 33.35,63.75 v33.2,63.9
  Bottom 0.254: v33.2,63.9 C2.1 C1.1 32,62.55 31.6,62.95 31.6,63.4 31.35,63.65 30.43,63.65 C3.1
  Bottom 0.61: C3.1 FB1.2
D33_U2  (via drill 0.3)
  Top 0.254: U2.3 33.3,51.25 v33.15,51.4
  Bottom 0.254: v33.15,51.4 C20.1 C19.1 32.25,50.9 31.7,51.45 30.77,51.45 C21.1
  Bottom 0.61: FB7.2 24.95,48.75 27.55,51.35 30.62,51.35 C21.1
D33_U3  (via drill 0.3)
  Top 0.254: v33.1,25.75 U3.3
  Bottom 0.254: v33.1,25.75 32.85,26 C47.1 C46.1
  Bottom 0.406: C46.1 30.9,26.85 30.65,27.1 29.38,27.1 29.3,27.18
  Bottom 0.61: FB13.2 29.3,27.18 C48.1
D33_U4  (via drill 0.3)
  Top 0.254: U4.3 64.7,29.25 v64.9,29.45
  Bottom 0.254: v64.9,29.45 C58.1 C57.1
  Bottom 0.406: C57.1 68.03,29.45 C59.1 FB19.2
D33_U5  (via drill 0.3)
  Top 0.254: U5.3 64.45,18.9 64.9,19.35 64.9,19.6 v65.1,19.8
  Bottom 0.254: C69.1 66.3,18.6 v65.1,19.8
  Bottom 0.406: FB25.2 C70.1 69.62,16.45 67.95,16.45 67.65,16.75 C68.1 C69.1
D33_U6  (via drill 0.3)
  Top 0.254: U6.3 63.9,8.25 v65.3,10
  Bottom 0.406: v65.3,10 C80.1 C79.1 68.15,10 68.65,9.5 68.65,8.1 68.95,7.8 70.28,7.8 C81.1 70.3,6.55 FB31.2
D33_U8  (via drill 0.3 pad 0.6)
  Top 0.254: U8.3 64.25,60.45 64.65,60.05 v65.1,60.05
  Bottom 0.254: v65.1,60.05 C91.1 C90.1 67.48,60.3 C92.1 FB41.2
DDS2CH1_ADDR0
  Top 0.254: CN2.22 23.75,67.75 23,68.5 CN5.7
DDS2CH1_ADDR1
  Top 0.254: CN5.8 22.85,68 23.6,67.25 CN2.24
DDS2CH1_ADDR2
  Top 0.254: CN2.26 23.45,66.75 22.7,67.5 CN5.9
DDS2CH1_ADDR3
  Top 0.254: CN5.10 22.55,67 23.3,66.25 CN2.28
DDS2CH1_ADDR4
  Top 0.254: CN2.30 23.15,65.75 22.4,66.5 CN5.11
DDS2CH1_ADDR5
  Top 0.254: CN2.32 23.45,64.25 21.7,66 CN5.12
DDS2CH1_D0
  Top 0.254: CN2.34 23.3,63.75 21.55,65.5 CN5.13
DDS2CH1_D1
  Top 0.254: CN2.36 23.15,63.25 21.4,65 CN5.14
DDS2CH1_D2
  Top 0.254: CN5.15 21.25,64.5 23,62.75 CN2.38
DDS2CH1_D3
  Top 0.254: CN5.16 21.1,64 22.85,62.25 CN2.40
DDS2CH1_D4
  Top 0.254: CN5.17 20.9,63.5 22.65,61.75 CN2.42
DDS2CH1_D5
  Top 0.254: CN2.44 22.45,61.25 20.7,63 CN5.18
DDS2CH1_D6
  Top 0.254: CN5.19 20.5,62.5 22.25,60.75 CN2.46
DDS2CH1_D7
  Top 0.254: CN2.48 22.1,60.25 20.35,62 CN5.20
DDS2CH1_FUD
  Top 0.254: CN5.23 19.6,60.5 21.85,58.25 CN2.52
DDS2CH1_PS0
  Top 0.254: CN5.25 19.3,59.5 21.55,57.25 CN2.56
DDS2CH1_PS1
  Top 0.254: CN2.54 21.7,57.75 19.45,60 CN5.24
DDS2CH1_RD
  Top 0.254: CN2.18 24.05,68.75 23.3,69.5 CN5.5
DDS2CH1_RST
  Top 0.254: CN5.26 19.15,59 23.9,54.25 CN2.68
DDS2CH1_SYNCLK
  Top 0.254: CN5.21 20.2,61.5 21.95,59.75 CN2.50
DDS2CH1_WR
  Top 0.254: CN5.6 23.15,69 23.9,68.25 CN2.20
DDS2CH2_ADDR0
  Top 0.254: CN6.7 15.05,44 23.5,51.25 CN2.76
DDS2CH2_ADDR1
  Top 0.254: CN6.8 15.25,43.5 23.6,50.75 CN2.78
DDS2CH2_ADDR2
  Top 0.254: CN6.9 15.45,43 23.75,50.25 CN2.80
DDS2CH2_ADDR3
  Top 0.254: CN4.18 23.8,30.75 17.9,42.5 CN6.10
DDS2CH2_ADDR4
  Top 0.254: CN6.11 17.6,42 23.5,30.25 CN4.20
DDS2CH2_ADDR5
  Top 0.254: CN4.22 23.2,29.75 17.25,41.5 CN6.12
DDS2CH2_D0
  Top 0.254: CN6.13 16.9,41 22.9,29.25 CN4.24
DDS2CH2_D1
  Top 0.254: CN4.26 22.6,28.75 16.6,40.5 CN6.14
DDS2CH2_D2
  Top 0.254: CN4.28 22.35,28.25 16.3,40 CN6.15
DDS2CH2_D3
  Top 0.254: CN6.16 15.95,39.5 22.05,27.75 CN4.30
DDS2CH2_D4
  Top 0.254: CN6.17 15.6,39 22.25,26.25 CN4.32
DDS2CH2_D5
  Top 0.254: CN4.34 21.95,25.75 15.3,38.5 CN6.18
DDS2CH2_D6
  Top 0.254: CN6.19 15,38 21.65,25.25 CN4.36
DDS2CH2_D7
  Top 0.254: CN6.20 14.65,37.5 21.35,24.75 CN4.38
DDS2CH2_FUD
  Top 0.254: CN4.44 19,23.25 13.7,36 CN6.23
DDS2CH2_PS0
  Top 0.254: CN4.48 18.35,22.25 13,35 CN6.25
DDS2CH2_PS1
  Top 0.254: CN6.24 13.35,35.5 18.7,22.7 CN4.46
DDS2CH2_RD
  Top 0.254: CN6.5 14.8,45 23.25,52.25 CN2.72
DDS2CH2_RST
  Top 0.254: CN6.26 12.65,34.5 18,21.75 CN4.50
DDS2CH2_SYNCLK
  Top 0.254: CN4.40 21,24.25 14.35,37 CN6.21
DDS2CH2_WR
  Top 0.254: CN2.74 23.35,51.75 14.9,44.5 CN6.6
DDS2CH3_ADDR0
  Top 0.254: CN7.7 22.45,19.5 22.7,19.25 CN4.56
DDS2CH3_ADDR1
  Top 0.254: CN7.8 22.3,19 22.55,18.75 CN4.58
DDS2CH3_ADDR2
  Top 0.254: CN7.9 22.15,18.5 22.4,18.25 CN4.60
DDS2CH3_ADDR3
  Top 0.254: CN7.10 22,18 22.25,17.75 CN4.62
DDS2CH3_ADDR4
  Top 0.254: CN7.11 21.85,17.5 22.1,17.25 CN4.64
DDS2CH3_ADDR5
  Top 0.254: CN7.12 21.7,17 21.95,16.75 CN4.66
DDS2CH3_D0
  Top 0.254: CN7.13 21.55,16.5 21.8,16.25 CN4.68
DDS2CH3_D1
  Top 0.254: CN7.14 21.35,16 21.6,15.75 CN4.70
DDS2CH3_D2
  Top 0.254: CN7.15 21.2,15.5 22.45,14.25 CN4.72
DDS2CH3_D3
  Top 0.254: CN7.16 21.05,15 22.3,13.75 CN4.74
DDS2CH3_D4
  Top 0.254: CN7.17 20.9,14.5 22.15,13.25 CN4.76
DDS2CH3_D5
  Top 0.254: CN7.18 20.75,14 22,12.75 CN4.78
DDS2CH3_D6
  Top 0.254: CN7.19 20.6,13.5 21.85,12.25 CN4.80
DDS2CH3_D7
  Top 0.254: CN7.20 20.45,13 21.7,11.75 CN4.82
DDS2CH3_FUD
  Top 0.254: CN7.23 18.6,11.5 19.85,10.25 CN4.88
DDS2CH3_PS0
  Top 0.254: CN7.25 18.3,10.5 20.55,8.25 CN4.92
DDS2CH3_PS1
  Top 0.254: CN7.24 18.45,11 19.7,9.75 CN4.90
DDS2CH3_RD
  Top 0.254: CN7.5 22.75,20.5 23,20.25 CN4.52
DDS2CH3_RST
  Top 0.254: CN7.26 18.15,10 20.4,7.75 CN4.94
DDS2CH3_SYNCLK
  Top 0.254: CN7.21 20.3,12.5 21.55,11.25 CN4.84
DDS2CH3_WR
  Top 0.254: CN7.6 22.6,20 22.85,19.75 CN4.54
DGND  (via drill 0.4, 0.6, 1)
  Top 0.254: CN3.G9 v76.5,9 76.75,9.25 U7.15 | CN3.G7 v76.55,15 | CN3.G1 v76.65,33 | CN3.G3 v76.65,27 | CN3.G5 v76.6,21 | v67.5,9 CN3.G10 | v67.45,15 CN3.G8 | v67.45,21 CN3.G6 | v67.4,27 CN3.G4 | v67.45,33 CN3.G2 | CN2.G3 v32.4,65 | CN2.G1 v32.55,71 | CN2.G7 v34.35,53 | CN2.G5 v32.5,59 | v23.45,53 CN2.G8 | CN2.G6 v22.9,59 21.9,59 19.9,61 CN5.22 | CN2.G4 v23.65,65 | CN2.G2 v23.6,71 | v67.45,71 CN1.G2 | CN1.G1 v76.55,71 | CN1.G3 v76.55,65 | v67.45,65 CN1.G4 | v66.45,59.4 67.4,59.4 67.8,59 CN1.G6 | CN1.G5 v76.55,59 | CN1.G7 v76.55,53 | v67.45,53 CN1.G8 | CN4.G1 v32.55,33 | CN4.G2 v23.45,33 | CN4.G3 v32.5,27 | CN4.G4 v23.45,27 | CN4.G6 v23.45,21 | CN4.G5 v32.55,21 | CN4.G7 v32.55,15 | CN4.G8 v23.45,15 | CN4.G10 v23.45,9 | CN4.G9 v32.55,9 | CN5.27 CN5.28 CN5.29 CN5.30 v18.35,56.35 | v18.35,72.2 CN5.1 CN5.2 CN5.3 CN5.4 | CN6.22 14,36.5 v16.45,31.35 | v11.7,47.75 CN6.1 CN6.2 CN6.3 CN6.4 | CN6.27 CN6.28 CN6.29 CN6.30 v11.7,31.65 | v16.25,23.25 16.25,22.8 15.95,22.5 CN7.1 CN7.2 CN7.3 CN7.4 | v15.2,7.1 CN7.30 CN7.29 CN7.28 CN7.27 | CN7.22 19.45,12 v20.05,11.4 | CN16.17 CN16.16 CN16.15 | CN16.15 CN16.14 | v83.15,25 CN16.15 | CN16.1 83.95,18 82.45,16.5 v81.95,16.5 | CN16.30 84.65,33.05 84.5,33.2 v84,33.2 | CN17.30 86.45,66.25 86.25,66.45 v86.25,67.05 | CN17.20 82.05,61.25 v81.75,61.5 | CN17.10 78.35,56.25 v78.05,56.55
  Top 0.406: v23.45,53 22.9,53.55 CN8.P$2 | CN8.P$3 18.35,54.17 v18.35,56.35 | CN19.2 79.7,45.95 v79.7,47
  Top 0.61: C32.2 v67.05,77.1 64.95,77.1 C30.P$2 | C33.2 v76.9,76.95 C31.P$2 | C36.2 v23,77.1 20.95,77.1 C34.P$2 | C37.2 v32.85,77.1 35.25,77.1 C35.P$2 | C40.2 v67.15,38.95 C38.P$2 | C41.2 v76.95,38.95 C39.P$2 | C44.2 23.3,38.45 v25.35,39.75 25.35,41.3 C42.P$2 | C45.2 v32.7,38.95 C43.P$2 | FB38.1 v87.85,38.85 v85.8,38.85
  pour Bottom (isolate 0.2): 0,0 100,0 100,80 0,80
DVDD  (via drill 0.3 pad 0.6, 0.3 pad 0.81, 0.6, 0.6 pad 1.27, 0.9, 1)
  Top 0.254: CN1.2 CN1.4 | CN1.3 CN1.1 | CN2.2 CN2.4 | CN2.3 CN2.1 | CN3.2 CN3.4 | CN3.3 CN3.1 | CN4.4 CN4.2 | CN4.3 CN4.1 | U7.16 78.75,8.75 78.55,8.55 v78.05,8.55
  Top 0.61: CN1.2 C32.1 C30.P$1 | C30.P$1 64.75,73.75 | C30.P$1 62.75,73.75 v62.65,73.65 | v81.25,73.75 C31.P$1 C33.1 CN1.1 | CN2.2 C36.1 C34.P$1 v20.8,70.85 | CN2.1 C37.1 C35.P$1 37.55,73.75 v37.6,73.7 | CN3.2 C40.1 C38.P$1 62.7,35.75 61.9,36.55 v61.9,39.75 | CN3.1 C41.1 C39.P$1 v82.35,35.75 | CN4.2 C44.1 22.45,35.75 21.35,37.75 C42.P$1 19.95,41.85 v19.95,45.25 | CN4.1 C45.1 C43.P$1 34.7,35.65 v37.1,35.65 | FB40.1 v87.95,45.45
  Top 0.813: v87.95,45.45 87.95,47.75
  Bottom 0.254: v65.75,53.6 66.45,53.6 68.05,55.2 C96.1 FB41.1 | FB45.1 61.15,74 61.65,73.65 v62.65,73.65
  Bottom 0.406: v34.15,70.05 C7.1 | FB5.1 36.5,58.25 v37.6,57.55 | 24.95,44.6 FB7.1 | v24.9,44.55 24.95,44.6 | 24.95,44.6 C25.1 | FB11.1 32.75,44.25 v31.95,43.45 | FB17.1 v33.25,18.3 | FB13.1 33.5,31.25 C52.1 v35.95,32.25 | v61.9,39.75 61.85,39.8 60.7,39.8 60.5,39.6 FB23.1 C63.1 | FB19.1 68.15,24.85 v67,23.65 | FB29.1 64.95,23.1 v65,23.05 | FB25.1 67.1,13.55 v66.7,13.7 | v66.7,13.7 C74.1 | FB35.1 66.35,14.05 v66.7,13.7 | FB31.1 67.64,3.9 v67.15,3.55 C85.1
  Bottom 0.61: FB1.1 32.2,70.05 v34.15,70.05
  other vias: 87.95,47.7
  pour Route3 (isolate 0.2): 0,0 0,80 100,80 100,0
N$1
  Top 0.254: U1.23 41.1,64.25 41.3,64.45 C11.1
N$2
  Top 0.254: U7.29 86.95,10.75 87.2,10.5 C12.1 R2.2
N$3
  Top 0.254: U7.30 86.95,11.25 87.2,11.5 C12.2 R3.2
N$4
  Top 0.254: U1.24 R1.2
N$5
  Top 0.254: R2.1 90.25,9.65 T2.3
N$6
  Top 0.254: U1.21 42.1,63.25 42.75,64.2 42.76,64.2 T1.1
N$7
  Top 0.254: R3.1 90.15,12.35 T2.1
N$8  (via drill 0.4, 0.6)
  Top 0.254: U7.23 U7.24 v83.45,6.9 82.65,6.05 C14.1
  Top 0.406: v91.35,11 T2.2
  Bottom 0.406: v91.35,11 91.35,9.25 90.55,8.4 83.9,8.4 83.45,8.05 v83.45,6.9 C13.P$1
N$9
  Top 0.254: U1.20 42.1,62.75 42.8,61.8 T1.3
N$11
  Top 0.254: T1.6 47.33,64.3
  Top 0.61: 47.33,64.3 CN11.P$1
N$12
  Top 0.406: T2.4 95.9,9.72 CN10.P$1
N$13  (via drill 0.6)
  Top 0.254: v23.3,56.25 CN2.60
  Top 0.406: CN8.P$1 v20.45,56.25
  Bottom 0.406: v20.45,56.25 v23.3,56.25
N$14
  Top 0.254: R4.1 R5.2 78.65,4.85 80.8,4.85 82.45,6.6 U7.22
N$15  (via drill 0.4)
  Top 0.254: U7.26 84.95,9.25 85.85,8.35 C16.2 C17.1
  Top 0.406: v87.9,7.6 87.65,7.85 C17.1
  Bottom 0.406: v87.9,7.6 C15.P$1
N$16  (via drill 0.4)
  Top 0.254: U7.25 84.3,8 84.45,7.85 C16.1 C18.1
  Top 0.406: C18.1 v85.75,6.9
  Bottom 0.406: v85.75,6.9 C15.P$2
N$18
  Top 0.254: C29.1 41.3,52.05 41,51.75 U2.23
N$19
  Top 0.254: U2.24 R6.2
N$20
  Top 0.254: U2.21 42.35,50.75 42.85,51.75 T3.1
N$21
  Top 0.254: U2.20 42.35,50.25 42.75,49.25 T3.3
N$22
  Top 0.406: T3.6 CN9.P$1
N$23
  Top 0.254: U3.23 41,26.25 41.2,26.45 C56.1
N$24
  Top 0.254: U3.24 R7.2
N$25
  Top 0.254: U3.21 42.1,25.25 42.55,26.15 T4.1
N$26
  Top 0.254: U3.20 42.1,24.75 42.5,23.65 T4.3
N$27
  Top 0.406: CN12.P$1 T4.6
N$28
  Top 0.254: U4.23 56.8,28.75 56.15,28.1 C67.1
N$29
  Top 0.254: U4.24 57.05,28.25 R8.2
N$30
  Top 0.254: U5.23 56.75,18.4 56.5,18.15 C78.1
N$31
  Top 0.254: U4.20 56,30.25 55.85,30.4 R9.2
N$32
  Top 0.254: CN13.P$1 54.95,29.75 | 54.95,29.75 U4.21 | 54.95,29.75 R10.2
N$33
  Top 0.254: R11.2 U5.24
N$34
  Top 0.254: U5.20 56.2,19.9 55.75,20.35 R12.2
N$35
  Top 0.254: 54.9,19.4 U5.21 | CN14.P$1 54.9,19.4 | 54.9,19.4 R13.2
N$36
  Top 0.254: U6.23 56.5,7.75 56.15,7.4 C89.1
N$37
  Top 0.254: U6.24 57.2,7.25 R14.2
N$38
  Top 0.254: R15.2 55.2,9.8 55.75,9.25 U6.20
N$39
  Top 0.254: U6.21 CN15.P$1 54.35,9.12 R16.2
N$40
  Top 0.254: CN17.29 84.75,65.75 82.95,68.75 CN1.17
N$41
  Top 0.254: CN1.19 82.7,68.25 84.5,65.25 CN17.28
N$42
  Top 0.254: CN17.27 84.25,64.75 82.45,67.75 CN1.21
N$43
  Top 0.254: CN1.23 82.25,67.25 84.05,64.25 CN17.26
N$44
  Top 0.254: CN1.25 81.9,66.75 83.7,63.75 CN17.25
N$45
  Top 0.254: CN1.27 81.55,66.25 83.35,63.25 CN17.24
N$46
  Top 0.254: CN1.29 81.2,65.75 83,62.75 CN17.23
N$47
  Top 0.254: CN17.22 82.7,62.25 81.45,64.25 CN1.31
N$48
  Top 0.254: CN17.21 82.4,61.75 81.15,63.75 CN1.33
N$49
  Top 0.254: CN17.19 81.4,60.75 79.55,63.25 CN1.35
N$50
  Top 0.254: CN1.37 79.25,62.75 81.15,60.25 CN17.18
N$51
  Top 0.254: CN1.39 78.95,62.25 80.9,59.75 CN17.17
N$52
  Top 0.254: CN1.41 78.65,61.75 80.6,59.25 CN17.16
N$53
  Top 0.254: CN1.43 78.35,61.25 80.3,58.75 CN17.15
N$54
  Top 0.254: CN1.45 78.05,60.75 80,58.25 CN17.14
N$55
  Top 0.254: CN1.47 77.75,60.25 79.7,57.75 CN17.13
N$56
  Top 0.254: CN1.49 77.45,59.75 79.45,57.25 CN17.12
N$57
  Top 0.254: CN1.51 77.7,58.25 79.15,56.75 CN17.11
N$58
  Top 0.254: CN1.61 CN17.9
N$59
  Top 0.254: CN1.63 CN17.8
N$60
  Top 0.254: CN1.65 CN17.7
N$61
  Top 0.254: CN1.67 CN17.6
N$62
  Top 0.254: CN1.69 CN17.5
N$63
  Top 0.254: CN1.71 81,52.25 82,53.25 CN17.4
N$64
  Top 0.254: CN1.73 81.2,51.75 82.2,52.75 CN17.3
N$65
  Top 0.254: CN1.75 81.4,51.25 82.4,52.25 CN17.2
N$66
  Top 0.254: CN1.77 81.6,50.75 82.6,51.75 CN17.1
N$67
  Top 0.61: FB38.2 FB37.2 90.95,41.3 91.15,41.5 93.67,41.5 CN20.1
N$68  (via drill 0.6)
  Top 0.254: CN1.11 v78,70.25
  Bottom 0.61: v78,70.25 86,70.25 86.55,70.8 CN18.1
N$69
  Top 0.254: CN1.79 77.1,50.25 78,49.35 78,45.35 78.7,44.65 80.4,44.65 CN19.1
N$70
  Top 0.61: FB40.2 FB39.2 91,43.05 91.3,42.75 93.67,42.75 CN20.2
N$71
  Top 0.254: U8.23 56.45,59.95 56.05,59.55 C100.1
N$72
  Top 0.254: R17.2 U8.24
N$73
  Top 0.254: U8.20 55.4,61.45 55.3,61.55 R18.2
N$74
  Top 0.254: U8.21 CN21.P$1 53.52,61.1 54.35,61.1 R19.2
U1_CLK
  Top 0.254: U1.12 37.1,59.1 36.65,58.65 34.4,58.65 33.4,59.75 CN2.49
U1_DB0
  Top 0.254: U1.5 32.5,62.75 32,63.25 CN2.35
U1_DB1
  Top 0.254: U1.4 32.8,63.25 32.3,63.75 CN2.33
U1_DB2
  Top 0.254: U1.2 33.75,64.25 33.45,64.55 32.9,64.55 32.6,64.25 CN2.31
U1_DB3
  Top 0.254: CN2.29 33.55,65.75 34,64.75 U1.1
U1_DB4
  Top 0.254: U1.32 34.7,65.8 34.25,66.25 CN2.27
U1_DB5
  Top 0.254: U1.31 36.1,66.7 36,66.8 35.2,66.8 35.15,66.75 CN2.25
U1_DB6
  Top 0.254: U1.30 36.6,66.9 36.25,67.25 CN2.23
U1_DB7
  Top 0.254: U1.29 37.1,67.1 36.45,67.75 CN2.21
U1_DB8
  Top 0.254: U1.28 37.6,67.3 36.65,68.25 CN2.19
U1_DB9
  Top 0.254: U1.27 38.1,67.5 36.85,68.75 CN2.17
U2_CLK
  Top 0.254: U2.12 37.1,46.55 36.5,45.95 34.1,45.95 32.65,47.4 32.65,49.7 32.1,50.25 CN2.79
U2_DB0
  Top 0.254: CN2.77 32.25,50.75 32.75,50.25 U2.5
U2_DB1
  Top 0.254: CN2.75 32.45,51.25 32.95,50.75 U2.4
U2_DB2
  Top 0.254: CN2.73 32.35,51.75 32.65,52.05 33.4,52.05 33.7,51.75 U2.2
U2_DB3
  Top 0.254: CN2.71 32.2,52.25 32.5,52.55 33.6,52.55 33.9,52.25 U2.1
U2_DB4
  Top 0.254: U2.32 35.05,53.3 34.6,53.75 CN2.69
U2_DB5
  Top 0.254: U2.31 36.1,54.05 35.85,54.3 35.15,54.3 35.05,54.25 CN2.67
U2_DB6
  Top 0.254: CN2.65 36.05,54.75 36.6,54.2 U2.30
U2_DB7
  Top 0.254: CN2.63 36.2,55.25 37.1,54.35 U2.29
U2_DB8
  Top 0.254: CN2.61 36.35,55.75 37.6,54.5 U2.28
U2_DB9
  Top 0.254: CN2.59 36.5,56.25 38.1,54.65 U2.27
U3_CLK
  Top 0.254: U3.12 37.1,20.6 36.75,20.25 CN4.51
U3_DB0
  Top 0.254: U3.5 34,24.75 33,23.75 CN4.41
U3_DB1
  Top 0.254: U3.4 33.75,25.25 32.75,24.25 CN4.39
U3_DB2
  Top 0.254: U3.2 33.6,26.25 33.45,26.4 32.8,26.4 32.65,26.25 CN4.31
U3_DB3
  Top 0.254: U3.1 33.9,26.75 32.9,27.75 CN4.29
U3_DB4
  Top 0.254: U3.32 33.75,27.8 33.3,28.25 CN4.27
U3_DB5
  Top 0.254: U3.31 36.1,28.7 35.95,28.85 35.05,28.85 34.95,28.75 CN4.25
U3_DB6
  Top 0.254: U3.30 36.6,28.9 36.2,29.3 34.75,29.3 34.65,29.25 CN4.23
U3_DB7
  Top 0.254: U3.29 37.1,29.1 36.35,29.85 34.6,29.85 34.5,29.75 CN4.21
U3_DB8
  Top 0.254: U3.28 37.6,29.3 36.6,30.3 34.35,30.3 34.3,30.25 CN4.19
U3_DB9
  Top 0.254: CN4.17 34.1,30.75 34.2,30.85 36.8,30.85 38.1,29.55 U3.27
U4_CLK
  Top 0.254: U4.12 60.6,34.1 61.05,34.55 63,34.55 66.8,30.75 CN3.18
U4_DB0
  Top 0.254: U4.5 63.8,30.25 64.25,30.7 66.05,30.7 66.5,30.25 CN3.20
U4_DB1
  Top 0.254: U4.4 64,29.75 64.35,30.1 65.9,30.1 66.25,29.75 CN3.22
U4_DB2
  Top 0.254: U4.2 65.6,28.75 66.1,29.25 CN3.24
U4_DB3
  Top 0.254: U4.1 65.75,28.25 66.25,28.75 CN3.26
U4_DB4
  Top 0.254: U4.32 65.4,27.2 66.45,28.25 CN3.28
U4_DB5
  Top 0.254: CN3.30 66.65,27.75 65.6,26.7 62.95,26.7 62.4,26.15 61.8,26.15 61.6,26.35 U4.31
U4_DB6
  Top 0.254: U4.30 61.1,26.2 61.6,25.7 62.6,25.7 63.15,26.25 CN3.32
U4_DB7
  Top 0.254: U4.29 60.6,26.05 61.4,25.25 62.85,25.25 63.35,25.75 CN3.34
U4_DB8
  Top 0.254: U4.28 60.1,25.9 61.2,24.8 63.05,24.8 63.5,25.25 CN3.36
U4_DB9
  Top 0.254: U4.27 59.6,25.75 61,24.35 63.25,24.35 63.65,24.75 CN3.38
U5_CLK
  Top 0.254: CN3.46 66.45,22.75 65.4,23.9 61.05,23.9 60.6,23.45 U5.12
U5_DB0
  Top 0.254: U5.5 63.85,19.9 63.85,20.55 65.55,22.25 CN3.48
U5_DB1
  Top 0.254: U5.4 64.2,19.4 64.4,19.6 64.4,20.15 66,21.75 CN3.50
U5_DB2
  Top 0.254: U5.2 64.7,18.4 65.55,19.25 CN3.56
U5_DB3
  Top 0.254: CN3.58 65.8,18.75 64.95,17.9 U5.1
U5_DB4
  Top 0.254: U5.32 64.65,16.85 66.05,18.25 CN3.60
U5_DB5
  Top 0.254: U5.31 61.6,15.95 61.75,15.8 62.4,15.8 63,16.4 64.9,16.4 66.25,17.75 CN3.62
U5_DB6
  Top 0.254: U5.30 61.1,15.8 61.55,15.35 62.6,15.35 63.2,15.95 65.15,15.95 66.45,17.25 CN3.64
U5_DB7
  Top 0.254: U5.29 60.6,15.65 61.4,14.85 62.75,14.85 63.4,15.5 65.4,15.5 66.65,16.75 CN3.66
U5_DB8
  Top 0.254: U5.28 60.1,15.5 61.25,14.35 62.95,14.35 63.6,15 65.55,15 66.8,16.25 CN3.68
U5_DB9
  Top 0.254: U5.27 59.6,15.35 61.05,13.9 63.15,13.9 63.8,14.55 65.8,14.55 67,15.75 CN3.70
U6_CLK
  Top 0.254: U6.12 60.4,13 60.85,13.45 65.15,13.45 66.35,12.25 CN3.80
U6_DB0
  Top 0.254: U6.5 63.45,9.25 64.8,11.75 CN3.82
U6_DB1
  Top 0.254: U6.4 63.75,8.75 64.25,9.4 65.15,11.25 CN3.84
U6_DB2
  Top 0.254: U6.2 64.05,7.75 67,10.75 CN3.86
U6_DB3
  Top 0.254: U6.1 64.2,7.25 67.15,10.25 CN3.88
U6_DB4
  Top 0.254: U6.32 63.8,6.2 67.3,9.75 CN3.90
U6_DB5
  Top 0.254: U6.31 61.4,5.35 61.6,5.15 63.4,5.15 66.5,8.25 CN3.92
U6_DB6
  Top 0.254: U6.30 60.9,5.15 61.4,4.65 63.55,4.65 66.65,7.75 CN3.94
U6_DB7
  Top 0.254: U6.29 60.4,5 61.2,4.2 63.75,4.2 66.8,7.25 CN3.96
U6_DB8
  Top 0.254: U6.28 59.9,4.85 61.05,3.7 63.9,3.7 66.95,6.75 CN3.98
U6_DB9
  Top 0.254: U6.27 59.4,4.65 60.85,3.2 64.05,3.2 67.1,6.25 CN3.100
U8_CLK
  Top 0.254: CN1.30 60.85,65.75 60.35,65.25 U8.12
U8_DB0
  Top 0.254: CN1.44 66.35,61.25 66.15,61.45 U8.5
U8_DB1
  Top 0.254: U8.4 65.9,60.95 66.1,60.75 CN1.46
U8_DB2
  Top 0.254: U8.2 63.9,59.95 65.6,58.25 CN1.52
U8_DB3
  Top 0.254: CN1.54 65.25,57.75 63.55,59.45 U8.1
U8_DB4
  Top 0.254: U8.32 62.25,58.4 63.4,57.25 CN1.56
U8_DB5
  Top 0.254: CN1.58 62.15,56.75 61.35,57.6 U8.31
U8_DB6
  Top 0.254: U8.30 60.85,57.4 61.95,56.25 CN1.60
U8_DB7
  Top 0.254: CN1.62 61.7,55.75 60.35,57.15 U8.29
U8_DB8
  Top 0.254: U8.28 59.85,56.95 61.45,55.25 CN1.64
U8_DB9
  Top 0.254: U8.27 59.35,56.7 61.2,54.75 CN1.66

## Text on the board
tNames: OPENCORE NMR | MB-002 | 2008 K.TAKEDA | G | DC | POWER